# EAGLE schematic SCIENTECH_2201 (EAGLE 9.6.1)
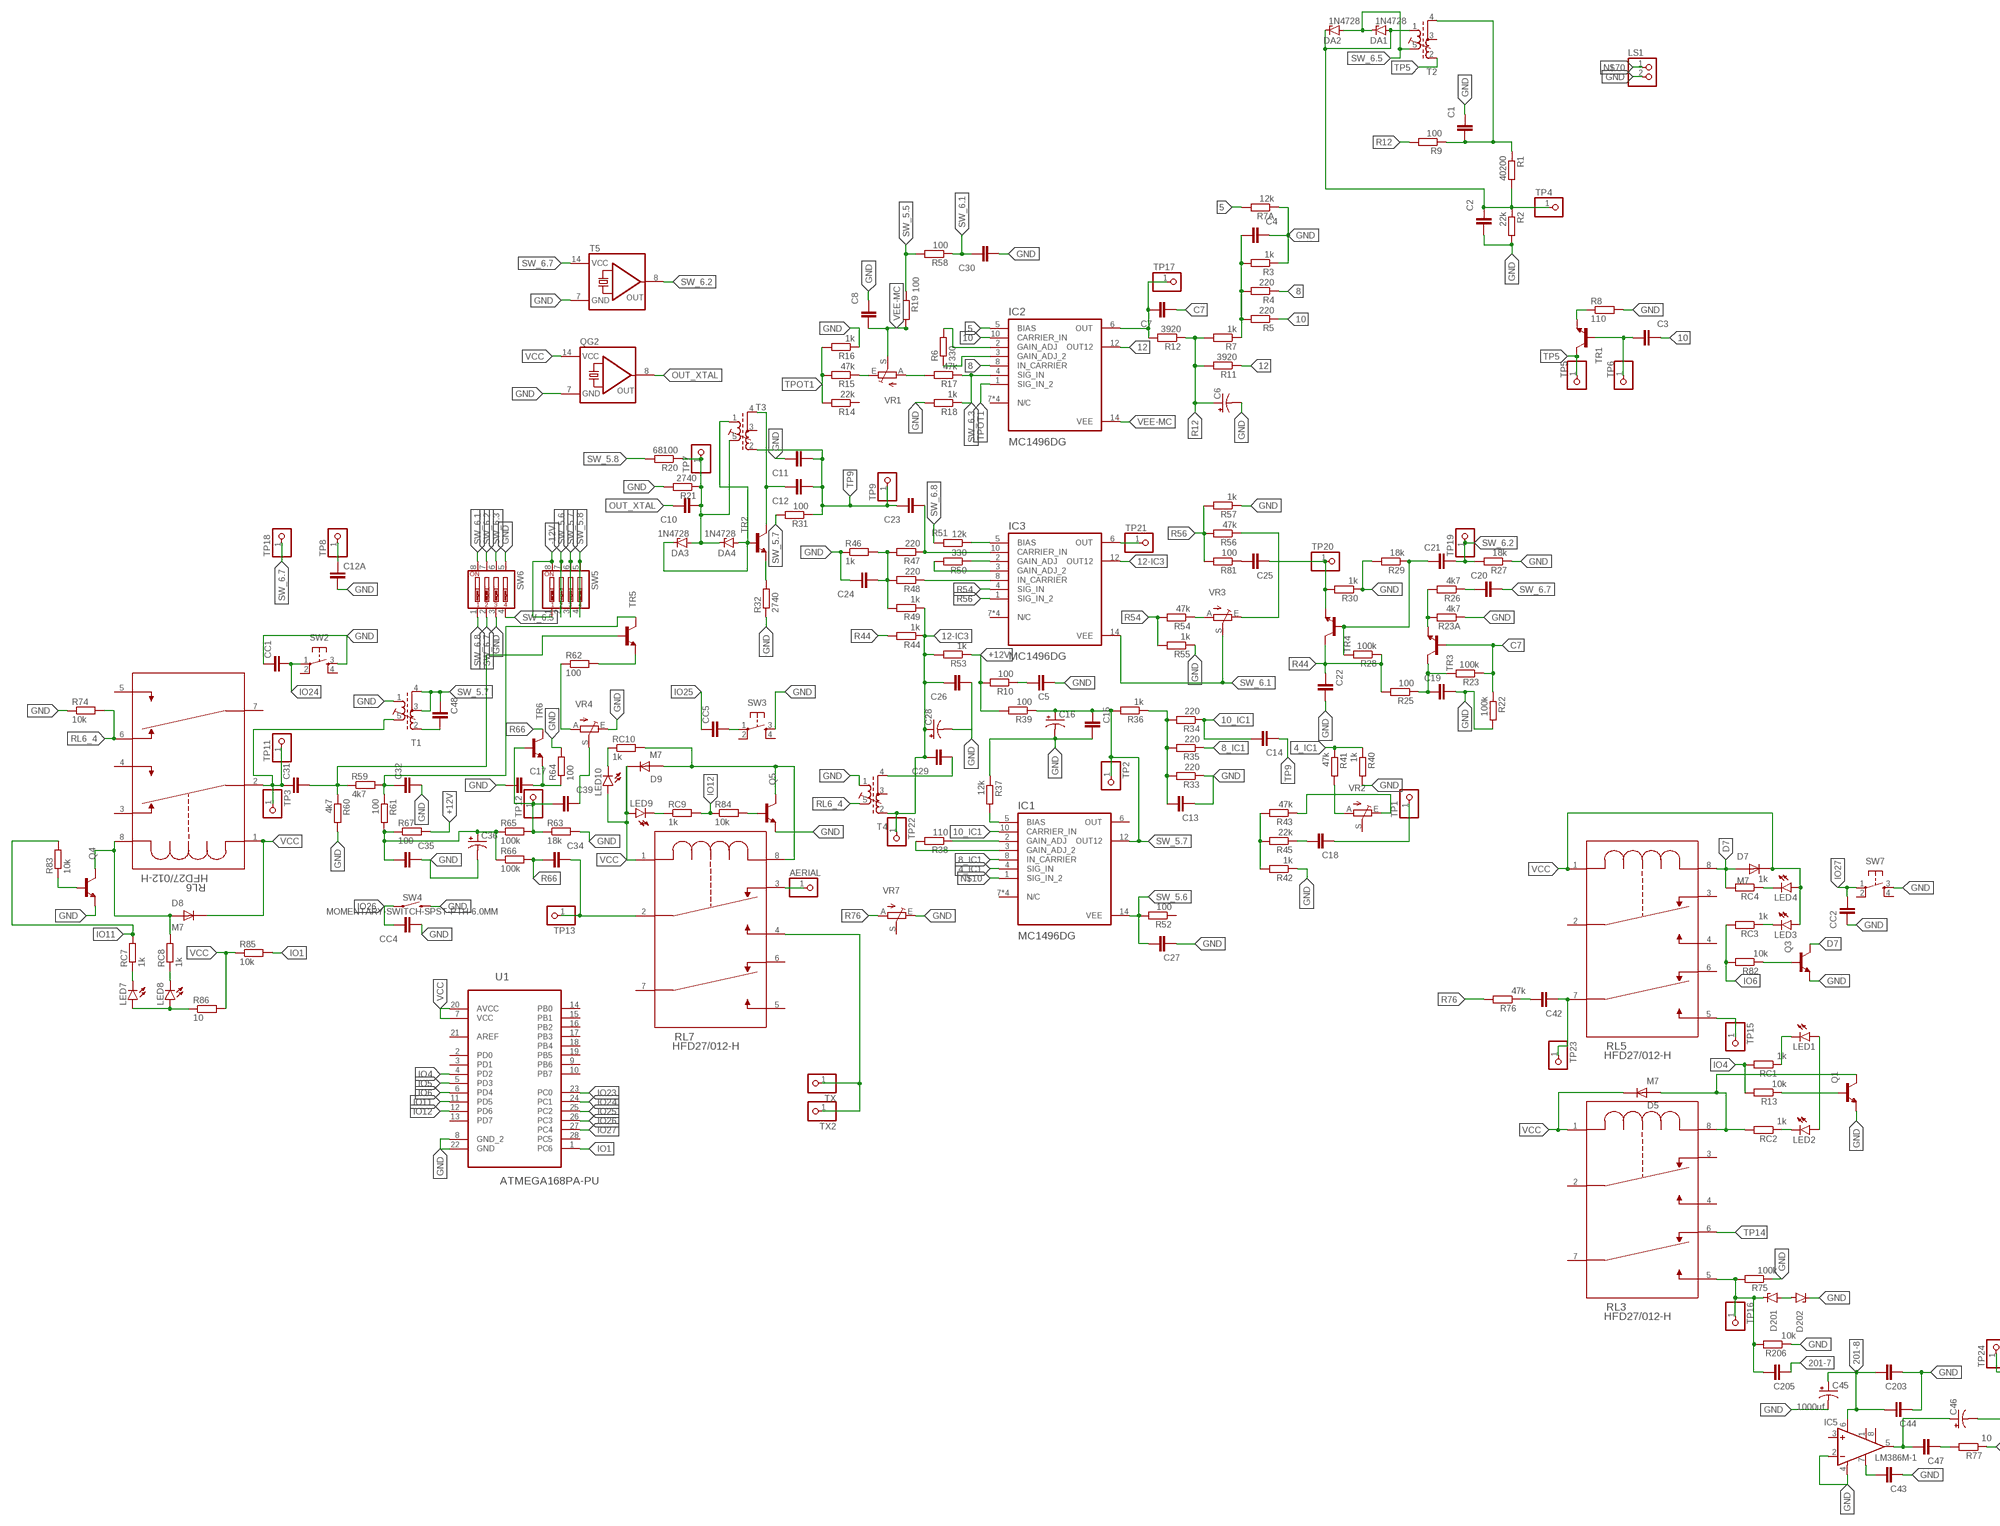
[diagram p0: schematic, sheet 1, part 1 of 2]
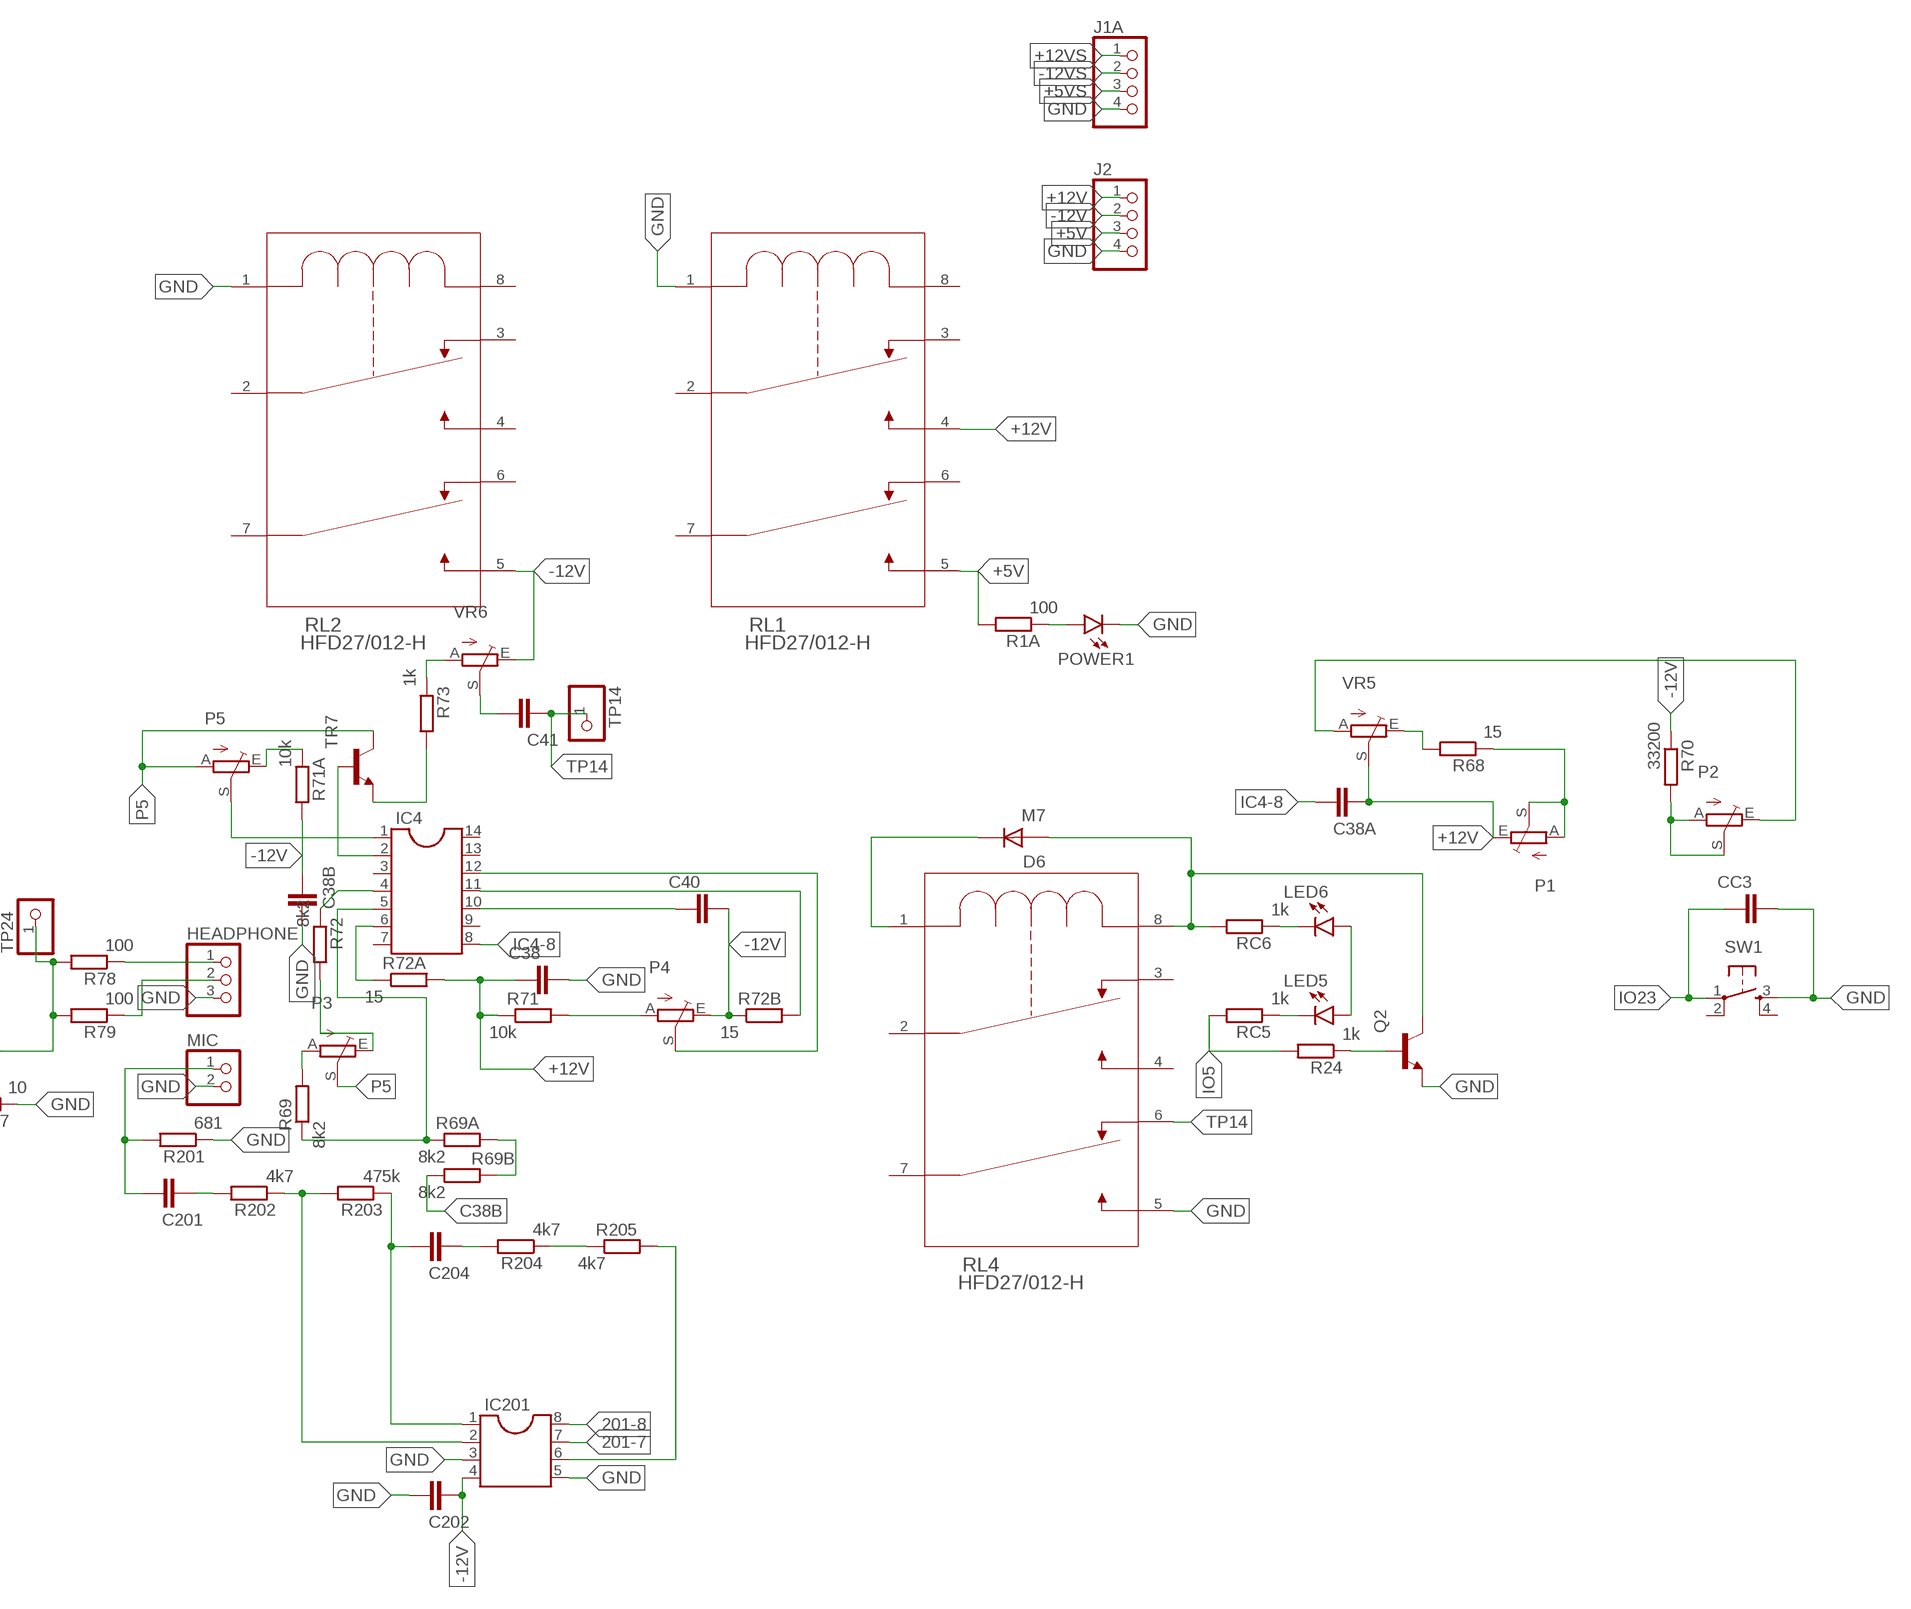
[diagram p1: schematic, sheet 1, part 2 of 2]

## Parts
AERIAL  PINHD-1X1  [1X01]
C1  C-EUC0805  [C0805]
C2  C-EUC0805  [C0805]
C3  C-EUC0805  [C0805]
C4  C-EUC0805  [C0805]
C5  C-EUC0805  [C0805]
C6  CPOL-US153CLV-0405  [153CLV-0405]
C7  C-EUC0805  [C0805]
C8  C-EUC0805  [C0805]
C10  C-EUC0805  [C0805]
C11  C-EUC0805  [C0805]
C12  C-EUC0805  [C0805]
C12A  C-EUC0805  [C0805]
C13  C-EUC0805  [C0805]
C14  C-EUC0805  [C0805]
C15  C-EUC0805  [C0805]
C16  CPOL-US153CLV-0405  [153CLV-0405]
C17  C-EUC0805  [C0805]
C18  C-EUC0805  [C0805]
C19  C-EUC0805  [C0805]
C20  C-EUC0805  [C0805]
C21  C-EUC0805  [C0805]
C22  C-EUC0805  [C0805]
C23  C-EUC0805  [C0805]
C24  C-EUC0805  [C0805]
C25  C-EUC0805  [C0805]
C26  C-EUC0805  [C0805]
C27  C-EUC0805  [C0805]
C28  CPOL-US153CLV-0405  [153CLV-0405]
C29  C-EUC0805  [C0805]
C30  C-EUC0805  [C0805]
C31  C-EUC0805  [C0805]
C32  C-EUC0805  [C0805]
C34  C-EUC0805  [C0805]
C35  C-EUC0805  [C0805]
C36  CPOL-US153CLV-0405  [153CLV-0405]
C38  C-EUC0805  [C0805]
C38A  C-EUC0805  [C0805]
C38B  C-EUC0805  [C0805]
C39  C-EUC0805  [C0805]
C40  C-EUC0805  [C0805]
C41  C-EUC0805  [C0805]
C42  C-EUC0805  [C0805]
C43  C-EUC0805  [C0805]
C44  C-EUC0805  [C0805]
C45  1000uf  CPOL-USE5-5  [E5-5]
C46  CPOL-US153CLV-0405  [153CLV-0405]
C47  C-EUC0805  [C0805]
C48  C-EUC0805  [C0805]
C201  C-EUC0805  [C0805]
C202  C-EUC0805  [C0805]
C203  C-EUC0805  [C0805]
C204  C-EUC0805  [C0805]
C205  C-EUC0805  [C0805]
CC1  C-EUC0805  [C0805]
CC2  C-EUC0805  [C0805]
CC3  C-EUC0805  [C0805]
CC4  C-EUC0805  [C0805]
CC5  C-EUC0805  [C0805]
D5  M7  [DIOM505270X240]
D6  M7  [DIOM505270X240]
D7  M7  [DIOM505270X240]
D8  M7  [DIOM505270X240]
D9  M7  [DIOM505270X240]
D201  1N4728  [DO41Z10]
D202  1N4728  [DO41Z10]
DA1  1N4728  [DO41Z10]
DA2  1N4728  [DO41Z10]
DA3  1N4728  [DO41Z10]
DA4  1N4728  [DO41Z10]
HEADPHONE  PINHD-1X3  [1X03]
IC1  MC1496DG  [SOIC127P600X175-14N]
IC2  MC1496DG  [SOIC127P600X175-14N]
IC3  MC1496DG  [SOIC127P600X175-14N]
IC4  DIL14  [DIL14]
IC5  LM386M-1  [SO08]
IC201  DIL8S  [SOCKET-08]
J1A  PINHD-1X4  [1X04]
J2  PINHD-1X4  [1X04]
LED1  LED3MM  [LED3MM]
LED2  LED3MM  [LED3MM]
LED3  LED3MM  [LED3MM]
LED4  LED3MM  [LED3MM]
LED5  LED3MM  [LED3MM]
LED6  LED3MM  [LED3MM]
LED7  LED3MM  [LED3MM]
LED8  LED3MM  [LED3MM]
LED9  LED3MM  [LED3MM]
LED10  LED3MM  [LED3MM]
LS1  PINHD-1X2  [1X02]
MIC  PINHD-1X2  [1X02]
P1  TRIM_EU-CA6V  [CA6V]
P2  TRIM_EU-CA6V  [CA6V]
P3  TRIM_EU-CA6V  [CA6V]
P4  TRIM_EU-CA6V  [CA6V]
P5  TRIM_EU-CA6V  [CA6V]
POWER1  LED3MM  [LED3MM]
Q1  1F  BC847  [SOT23]
Q2  1F  BC847  [SOT23]
Q3  1F  BC847  [SOT23]
Q4  1F  BC847  [SOT23]
Q5  1F  BC847  [SOT23]
QG2  QG5860  [DIL14S]
R1  40200  R-EU_R0805  [R0805]
R1A  100  R-EU_R0805  [R0805]
R2  22k  R-EU_R0805  [R0805]
R3  1k  R-EU_R0805  [R0805]
R4  220  R-EU_R0805  [R0805]
R5  220  R-EU_R0805  [R0805]
R6  330  R-EU_R0805  [R0805]
R7  1k  R-EU_R0805  [R0805]
R7A  12k  R-EU_R0805  [R0805]
R8  110  R-EU_R0805  [R0805]
R9  100  R-EU_R0805  [R0805]
R10  100  R-EU_R0805  [R0805]
R11  3920  R-EU_R0805  [R0805]
R12  3920  R-EU_R0805  [R0805]
R13  10k  R-EU_R0805  [R0805]
R14  22k  R-EU_R0805  [R0805]
R15  47k  R-EU_R0805  [R0805]
R16  1k  R-EU_R0805  [R0805]
R17  47k  R-EU_R0805  [R0805]
R18  1k  R-EU_R0805  [R0805]
R19  100  R-EU_R0805  [R0805]
R20  68100  R-EU_R0805  [R0805]
R21  2740  R-EU_R0805  [R0805]
R22  100k  R-EU_R0805  [R0805]
R23  100k  R-EU_R0805  [R0805]
R23A  4k7  R-EU_R0805  [R0805]
R24  1k  R-EU_R0805  [R0805]
R25  100  R-EU_R0805  [R0805]
R26  4k7  R-EU_R0805  [R0805]
R27  18k  R-EU_R0805  [R0805]
R28  100k  R-EU_R0805  [R0805]
R29  18k  R-EU_R0805  [R0805]
R30  1k  R-EU_R0805  [R0805]
R31  100  R-EU_R0805  [R0805]
R32  2740  R-EU_R0805  [R0805]
R33  220  R-EU_R0805  [R0805]
R34  220  R-EU_R0805  [R0805]
R35  220  R-EU_R0805  [R0805]
R36  1k  R-EU_R0805  [R0805]
R37  12k  R-EU_R0805  [R0805]
R38  110  R-EU_R0805  [R0805]
R39  100  R-EU_R0805  [R0805]
R40  1k  R-EU_R0805  [R0805]
R41  47k  R-EU_R0805  [R0805]
R42  1k  R-EU_R0805  [R0805]
R43  47k  R-EU_R0805  [R0805]
R44  1k  R-EU_R0805  [R0805]
R45  22k  R-EU_R0805  [R0805]
R46  1k  R-EU_R0805  [R0805]
R47  220  R-EU_R0805  [R0805]
R48  220  R-EU_R0805  [R0805]
R49  1k  R-EU_R0805  [R0805]
R50  330  R-EU_R0805  [R0805]
R51  12k  R-EU_R0805  [R0805]
R52  100  R-EU_R0805  [R0805]
R53  1k  R-EU_R0805  [R0805]
R54  47k  R-EU_R0805  [R0805]
R55  1k  R-EU_R0805  [R0805]
R56  47k  R-EU_R0805  [R0805]
R57  1k  R-EU_R0805  [R0805]
R58  100  R-EU_R0805  [R0805]
R59  4k7  R-EU_R0805  [R0805]
R60  4k7  R-EU_R0805  [R0805]
R61  100  R-EU_R0805  [R0805]
R62  100  R-EU_R0805  [R0805]
R63  18k  R-EU_R0805  [R0805]
R64  100  R-EU_R0805  [R0805]
R65  100k  R-EU_R0805  [R0805]
R66  100k  R-EU_R0805  [R0805]
R67  100  R-EU_R0805  [R0805]
R68  15  R-EU_R0805  [R0805]
R69  8k2  R-EU_R0805  [R0805]
R69A  8k2  R-EU_R0805  [R0805]
R69B  8k2  R-EU_R0805  [R0805]
R70  33200  R-EU_R0805  [R0805]
R71  10k  R-EU_R0805  [R0805]
R71A  10k  R-EU_R0805  [R0805]
R72  8k2  R-EU_R0805  [R0805]
R72A  15  R-EU_R0805  [R0805]
R72B  15  R-EU_R0805  [R0805]
R73  1k  R-EU_R0805  [R0805]
R74  10k  R-EU_R0805  [R0805]
R75  100k  R-EU_R0805  [R0805]
R76  47k  R-EU_R0805  [R0805]
R77  10  R-EU_R0805  [R0805]
R78  100  R-EU_R0805  [R0805]
R79  100  R-EU_R0805  [R0805]
R81  100  R-EU_R0805  [R0805]
R82  10k  R-EU_R0805  [R0805]
R83  10k  R-EU_R0805  [R0805]
R84  10k  R-EU_R0805  [R0805]
R85  10k  R-EU_R0805  [R0805]
R86  10  R-EU_R0805  [R0805]
R201  681  R-EU_R0805  [R0805]
R202  4k7  R-EU_R0805  [R0805]
R203  475k  R-EU_R0805  [R0805]
R204  4k7  R-EU_R0805  [R0805]
R205  4k7  R-EU_R0805  [R0805]
R206  10k  R-EU_R0805  [R0805]
RC1  1k  R-EU_R0805  [R0805]
RC2  1k  R-EU_R0805  [R0805]
RC3  1k  R-EU_R0805  [R0805]
RC4  1k  R-EU_R0805  [R0805]
RC5  1k  R-EU_R0805  [R0805]
RC6  1k  R-EU_R0805  [R0805]
RC7  1k  R-EU_R0805  [R0805]
RC8  1k  R-EU_R0805  [R0805]
RC9  1k  R-EU_R0805  [R0805]
RC10  1k  R-EU_R0805  [R0805]
RL1  HFD27/012-H  [RELAY_HFD27_HNG]
RL2  HFD27/012-H  [RELAY_HFD27_HNG]
RL3  HFD27/012-H  [RELAY_HFD27_HNG]
RL4  HFD27/012-H  [RELAY_HFD27_HNG]
RL5  HFD27/012-H  [RELAY_HFD27_HNG]
RL6  HFD27/012-H  [RELAY_HFD27_HNG]
RL7  HFD27/012-H  [RELAY_HFD27_HNG]
SW1  TAC_SWITCHPTH  [TACTILE-PTH]
SW2  TAC_SWITCHPTH  [TACTILE-PTH]
SW3  TAC_SWITCHPTH  [TACTILE-PTH]
SW4  MOMENTARY-SWITCH-SPST-PTH-6.0MM  [TACTILE_SWITCH_PTH_6.0MM]
SW5  SW_DIP-4  [EDG-04]
SW6  SW_DIP-4  [EDG-04]
SW7  TAC_SWITCHPTH  [TACTILE-PTH]
T1  71-24513-2  [71-5]
T2  71-24513-2  [71-5]
T3  71-24513-2  [71-5]
T4  71-24513-2  [71-5]
T5  QG5860  [DIL14S]
TP1  PINHD-1X1  [1X01]
TP2  PINHD-1X1  [1X01]
TP3  PINHD-1X1  [1X01]
TP4  PINHD-1X1  [1X01]
TP5  PINHD-1X1  [1X01]
TP6  PINHD-1X1  [1X01]
TP7  PINHD-1X1  [1X01]
TP8  PINHD-1X1  [1X01]
TP9  PINHD-1X1  [1X01]
TP11  PINHD-1X1  [1X01]
TP12  PINHD-1X1  [1X01]
TP13  PINHD-1X1  [1X01]
TP14  PINHD-1X1  [1X01]
TP15  PINHD-1X1  [1X01]
TP16  PINHD-1X1  [1X01]
TP17  PINHD-1X1  [1X01]
TP18  PINHD-1X1  [1X01]
TP19  PINHD-1X1  [1X01]
TP20  PINHD-1X1  [1X01]
TP21  PINHD-1X1  [1X01]
TP22  PINHD-1X1  [1X01]
TP23  PINHD-1X1  [1X01]
TP24  PINHD-1X1  [1X01]
TR1  1AM  BC847  [SOT23]
TR2  1AM  BC847  [SOT23]
TR3  1AM  BC847  [SOT23]
TR4  1AM  BC847  [SOT23]
TR5  1AM  BC847  [SOT23]
TR6  1AM  BC847  [SOT23]
TR7  1AM  BC847  [SOT23]
TX  PINHD-1X1  [1X01]
TX2  PINHD-1X1  [1X01]
U1  ATMEGA168PA-PU  [DIP254P762X457-28]
VR1  TRIM_EU-PT10S  [PT-10S]
VR2  TRIM_EU-PT10S  [PT-10S]
VR3  TRIM_EU-PT10S  [PT-10S]
VR4  TRIM_EU-PT10S  [PT-10S]
VR5  TRIM_EU-PT10S  [PT-10S]
VR6  TRIM_EU-PT10S  [PT-10S]
VR7  TRIM_EU-PT10S  [PT-10S]

## Nets
4_IC1: IC1.4(SIG_IN) R40.1 R41.1
5: IC2.5(BIAS) R7A.2
8: IC2.8(IN_CARRIER) R4.1
8_IC1: IC1.8(IN_CARRIER) R35.1
10: C3.2 IC2.10(CARRIER_IN) R5.1
10_IC1: C14.2 IC1.10(CARRIER_IN) R34.1
12: IC2.12(OUT12) R11.1
12-IC3: C26.2 C28.+ C29.2 IC3.12(OUT12) R44.1 R49.1 R53.2 T4.2(A1) TP22.1
201-7: C205.1 IC201.7
201-8: C44.2 C45.+ C203.2 IC5.6(VS) IC201.8
+5V: J2.3 R1A.2 RL1.5
+5VS: J1A.3
+12V: C38.1 C38A.1 J2.1 P1.E R10.2 R39.2 R53.1 R67.2 R71.1 R72A.2 RL1.4 VR5.S
+12VS: J1A.1
-12V: C38B.1 C40.2 C202.1 IC201.4 J2.2 P4.E R70.1 R71A.2 R72B.1 RL2.5 SW5.1 SW5.8 VR6.E
-12VS: J1A.2
C7: C7.1 R22.1 R23.1 TR3.1(B)
C38B: R69B.1
D7: D7.A Q3.3(C) RC4.2 RL5.8
GND: C1.2 C2.1 C4.2 C5.1 C6.- C8.2 C11.2 C12A.2 C13.1 C15.2 C16.- C17.1 C19.2 C22.2 C24.2 C26.1 C27.1 C28.- C30.1 C32.2 C35.2 C36.- C38.2 C38B.2 C43.1 C44.1 C45.- C202.2 C203.1 CC1.1 CC2.1 CC3.2 CC4.1 D202.C HEADPHONE.3 IC5.2(-IN) IC5.4(GND) IC201.3 IC201.5 J1A.4 J2.4 LS1.2 MIC.2 POWER1.K(C) Q1.2(E) Q2.2(E) Q3.2(E) Q4.2(E) Q5.2(E) QG2.7(GND) R2.2 R3.1 R7A.1 R8.2 R16.1 R18.2 R21.2 R22.2 R23A.1 R27.1 R29.2 R30.1 R32.1 R33.1 R37.1 R40.2 R42.1 R46.1 R55.1 R57.1 R60.2 R63.2 R64.2 R74.1 R75.1 R77.1 R201.1 R206.1 RL1.1 RL2.1 RL4.5 SW1.3 SW2.3 SW3.3 SW4.3 SW6.3 SW6.5 SW7.3 T1.1(E2) T4.1(E2) T5.7(GND) U1.8(GND_2) U1.22(GND) VR4.E VR7.E
IC4-8: C38A.2 IC4.8
IO1: R85.2 U1.1(PC6)
IO4: R13.2 RC1.2 U1.4(PD2)
IO5: R24.2 RC5.2 U1.5(PD3)
IO6: R82.2 RC3.2 U1.6(PD4)
IO11: R83.2 RC7.2 U1.11(PD5)
IO12: R84.1 RC9.2 U1.12(PD6)
IO23: CC3.1 SW1.1 U1.23(PC0)
IO24: CC1.2 SW2.1 U1.24(PC1)
IO25: CC5.1 U1.25(PC2)
IO26: CC4.2 SW4.1 U1.26(PC3)
IO27: CC2.2 SW7.1 U1.27(PC4)
N$2: LED7.A LED8.A R86.1
N$3: LED7.K(C) RC7.1
N$4: LED8.K(C) RC8.1
N$5: D8.A Q4.3(C) RC8.2 RL6.8
N$6: C48.2 T1.2(A1)
N$7: D9.A Q5.3(C) RC10.2 RL7.8
N$8: C31.2 R59.1 R60.1 TR5.1(B)
N$9: C32.1 R59.2 R61.1 TR5.3(C)
N$10: IC1.1(SIG_IN_2)
N$11: C5.2 R10.1
N$12: C39.1 R63.1 R65.2 TP12.1 TR6.1(B)
N$13: RL7.4 TX2.1 TX.1
N$14: C34.2 RL7.2(3_2) TP13.1
N$15: LED9.K(C) RC9.1
N$16: LED10.K(C) RC10.1
N$17: Q5.1(B) R84.2
N$18: AERIAL.1 RL7.3
N$19: CC5.2 SW3.1
N$20: Q4.1(B) R83.1
N$21: IC2.3(GAIN_ADJ_2) R6.1
N$22: IC2.2(GAIN_ADJ) R6.2
N$23: R17.2 VR1.A
N$24: R15.1 VR1.E
N$26: C21.1 R28.2 R29.1 TR4.1(B)
N$27: C7.2 IC2.6(OUT) R12.2 TP17.1
N$28: C29.1 T4.4(E1)
N$29: C4.1 R3.2 R4.2 R5.2 R7.1
N$30: IC3.2(GAIN_ADJ) R50.1
N$31: IC3.3(GAIN_ADJ_2) R50.2
N$32: IC3.6(OUT) TP21.1
N$33: IC3.5(BIAS) R51.1
N$34: IC3.8(IN_CARRIER) R48.1
N$35: C23.1 IC3.10(CARRIER_IN) R47.1
N$36: C24.1 R46.2 R47.2 R48.2 R49.2
N$37: C12.2 T3.4(E1) TR2.3(C)
N$38: R32.2 TR2.2(E)
N$39: DA3.C DA4.A T3.1(E2) TR2.1(B)
N$40: C10.1 DA3.A DA4.C R20.1 R21.1 T3.5(A2) TP7.1
N$41: C25.2 R81.1
N$42: R54.1 VR3.A
N$43: R56.1 VR3.E
N$44: C25.1 R30.2 TP20.1 TR4.2(E)
N$45: IC1.2(GAIN_ADJ) R38.1
N$47: C19.1 R23.2 R25.1 TR3.3(C)
N$48: C13.2 R33.2 R34.2 R35.2 R36.1
N$49: R23A.2 R26.2 TR3.2(E)
N$50: C20.1 R26.1
N$51: IC1.3(GAIN_ADJ_2) R38.2
N$52: R42.2 R43.2 R45.2
N$53: C18.2 R45.1
N$54: R43.1 VR2.E
N$55: C18.1 TP1.1
N$56: R41.2 VR2.A
N$57: IC1.5(BIAS) R37.2
N$58: C39.2 VR4.S
N$59: C1.1 R1.1 R9.1 T2.4(E1)
N$60: R8.1 TR1.2(E)
N$61: C3.1 TP6.1 TR1.1(B)
N$62: C12A.1 TP8.1
N$63: LED4.K(C) RC4.1
N$64: LED3.K(C) RC3.1
N$66: Q3.1(B) R82.1
N$67: RL5.5 TP15.1
N$68: C42.1 RL5.7 TP23.1
N$69: C42.2 R76.1
N$70: LS1.1
N$72: D5.A Q1.3(C) RC2.2 RL3.8
N$73: LED1.A LED2.A
N$74: LED1.K(C) RC1.1
N$75: LED2.K(C) RC2.1
N$76: Q1.1(B) R13.1
N$77: C205.2 D201.C R75.2 R206.2 RL3.5 TP16.1
N$78: D201.A D202.A
N$79: C46.+ C47.2 IC5.5(OUT)
N$80: POWER1.A R1A.1
N$81: C43.2 IC5.7(BYPASS)
N$82: C47.1 R77.2
N$83: C46.- R78.2 R79.2 TP24.1
N$84: HEADPHONE.1 R78.1
N$85: HEADPHONE.2 R79.1
N$86: C201.2 MIC.1 R201.2
N$87: C201.1 R202.2
N$88: IC201.2 R202.1 R203.2
N$89: C204.2 IC201.1 R203.1
N$90: C204.1 R204.2
N$91: R204.1 R205.1
N$92: P2.A P2.S R70.2
N$93: IC201.6 R205.2
N$94: C41.2 VR6.S
N$95: R73.1 VR6.A
N$96: R73.2 TR7.2(E)
N$97: R69A.2 R69B.2
N$98: P5.E R71A.1
N$99: IC4.2 TR7.1(B)
N$100: IC4.1 P5.S
N$101: IC4.6 R72A.1
N$102: IC4.4 R72.1
N$103: P3.E R72.2
N$104: P3.A R69.2
N$105: IC4.5 R69.1 R69A.1
N$106: D6.C RL4.1
N$107: P4.A R71.2
N$108: R68.2 VR5.E
N$109: IC4.11 R72B.2
N$110: C40.1 IC4.10
N$111: IC4.12 P4.S
N$112: D6.A Q2.3(C) RC6.2 RL4.8
N$113: P1.A P1.S R68.1
N$114: LED6.K(C) RC6.1
N$115: LED5.A LED6.A
N$116: LED5.K(C) RC5.1
N$117: P2.E VR5.A
N$118: Q2.1(B) R24.1
N$119: C2.2 DA1.A DA2.C R1.2 R2.1 T2.1(E2) TP4.1
N$121: R62.1 VR4.A
N$122: R62.2 TR5.2(E)
N$123: C17.2 R64.1 TR6.2(E)
OUT_XTAL: C10.2 QG2.8(OUT)
P5: P3.S P5.A TR7.3(C)
R12: C6.+ R7.2 R9.2 R11.2 R12.1
R44: C22.1 R25.2 R28.1 R44.2 TR4.3(C)
R54: IC3.4(SIG_IN) R54.2 R55.2
R56: IC3.1(SIG_IN_2) R56.2 R57.2 R81.2
R66: C34.1 R66.2 TR6.3(C)
R67: C35.1 C36.+ R61.2 R65.1 R66.1 R67.1
R76: R76.2 VR7.A
RL6_4: R74.2 RL6.6 T4.5(A2)
SW_5.5: R19.1 R58.2
SW_5.6: C27.2 IC1.14(VEE) R52.2 SW5.2 SW5.7
SW_5.7: C15.1 C16.+ C48.1 IC1.12(OUT12) R31.2 R36.2 R39.1 SW5.3 SW5.6 T1.3(Z) T1.4(E1) TP2.1
SW_5.8: R20.2 SW5.4 SW5.5
SW_6.1: C30.2 IC3.14(VEE) R58.1 SW6.8 VR3.S
SW_6.2: C21.2 R27.2 SW6.7 T5.8(OUT) TP19.1
SW_6.3: IC2.4(SIG_IN) R17.1 R18.1 SW6.6
SW_6.5: DA1.C DA2.A SW6.4 T2.5(A2)
SW_6.7: C20.2 SW6.2 T5.14(VCC) TP18.1
SW_6.8: R51.2 SW6.1
TP3: C31.1 RL6.2(3_2) T1.5(A2) TP3.1 TP11.1
TP5: T2.2(A1) TP5.1 TR1.3(C)
TP9: C11.1 C12.1 C14.1 C23.2 R31.1 T3.2(A1) TP9.1
TP14: C41.1 RL3.6 RL4.6 TP14.1
TPOT1: IC2.1(SIG_IN_2) R14.2 R15.2 R16.2
VCC: D5.C D7.C D8.C D9.C LED3.A LED4.A LED9.A LED10.A QG2.14(VCC) R85.1 R86.2 RL3.1 RL5.1 RL6.1 RL7.1 U1.7(VCC) U1.20(AVCC)
VEE-MC: C8.1 IC2.14(VEE) R19.2 VR1.S
Unconnected: IC1.6(OUT) IC1.7(N/C) IC1.9(N/C) IC1.11(N/C) IC1.13(N/C) IC2.7(N/C) IC2.9(N/C) IC2.11(N/C) IC2.13(N/C) IC3.7(N/C) IC3.9(N/C) IC3.11(N/C) IC3.13(N/C) IC4.3 IC4.7 IC4.9 IC4.13 IC4.14 IC5.1(GAIN) IC5.3(+IN) IC5.8(GAIN) R14.1 R52.1 RL1.2(3_2) RL1.3 RL1.6 RL1.7 RL1.8 RL2.2(3_2) RL2.3 RL2.4 RL2.6 RL2.7 RL2.8 RL3.2(3_2) RL3.3 RL3.4 RL3.7 RL4.2(3_2) RL4.3 RL4.4 RL4.7 RL5.2(3_2) RL5.3 RL5.4 RL5.6 RL6.3 RL6.4 RL6.5 RL6.7 RL7.5 RL7.6 RL7.7 SW1.2 SW1.4 SW2.2 SW2.4 SW3.2 SW3.4 SW7.2 SW7.4 T1.S1 T1.S2 T2.3(Z) T2.S1 T2.S2 T3.3(Z) T3.S1 T3.S2 T4.3(Z) T4.S1 T4.S2 U1.2(PD0) U1.3(PD1) U1.9(PB6) U1.10(PB7) U1.13(PD7) U1.14(PB0) U1.15(PB1) U1.16(PB2) U1.17(PB3) U1.18(PB4) U1.19(PB5) U1.21(AREF) U1.28(PC5) VR2.S VR7.S

## Library data of the parts
AERIAL TP1-TP9 TP11-TP24 TX TX2 = adafruit:PINHD-1X1: Pin header 1x1 for 0.1" spacing With round pins
C1-C5 C7 C8 C10-C12 C12A C13-C15 C17-C27 C29-C32 C34 C35 C38 C38A C38B C39-C44 C47 C48 C201-C205 CC1-CC5 = rcl:C-EU: CAPACITOR, European symbol; SPICEPREFIX: C
C6 C16 C28 C36 C45 C46 = rcl:CPOL-US: POLARIZED CAPACITOR, American symbol; SPICEPREFIX: C
D5-D9 = M7:M7: none Check availability <https://pricing.snapeda.com/parts/M7/Diotec%20Semiconductor/view-part?ref=eda>; AVAILABILITY: In Stock; DESCRIPTION: Diode Standard 1000 V 1A Surface Mount DO-214AC (SMA); MF: Diotec Semiconductor; MP: M7; PACKAGE: None; PRICE: None; PURCHASE-URL: https://pricing.snapeda.com/search/part/M7/?ref=eda
D201 D202 DA1-DA4 = diode:1N4728: Z DIODE 3.3 V, 1W, 5 percent
HEADPHONE = adafruit:PINHD-1X3: PIN HEADER
IC1-IC3 = MC1496DG:MC1496DG: Check availability <https://pricing.snapeda.com/parts/MC1496DG/ON%20Semiconductor/view-part?ref=eda>; AVAILABILITY: In Stock; CHECK_PRICES: https://www.snapeda.com/parts/MC1496DG/Onsemi/view-part/?ref=eda; DESCRIPTION: RF IC Modulator/Demodulator FM 300MHz - 14-SOIC; MF: ON Semiconductor; MP: MC1496DG; PACKAGE: SOIC-14 ON Semiconductor; PRICE: None; PURCHASE-URL: https://www.snapeda.com/api/url_track_click_mouser/?unipart_id=214251&manufacturer=ON Semiconductor&part_name=MC1496DG&search_term=None; SNAPEDA_LINK: https://www.snapeda.com/parts/MC1496DG/Onsemi/view-part/?ref=snap
IC4 = ic-package:DIL14: Dual In Line / Socket
IC5 = linear:LM386?-*: Low Voltage Audio Power Amplifier Source: http://cache.national.com/ds/LM/LM386.pdf
IC201 = ic-package:DIL8: Dual In Line / Socket
J1A J2 = pinhead:PINHD-1X4: PIN HEADER
LED1-LED10 POWER1 = led:LED: LED OSRAM: - CHIPLED LG R971, LG N971, LY N971, LG Q971, LY Q971, LO R971, LY R971 LH N974, LH R974 LS Q976, LO Q976, LY Q976 LO Q996 - Hyper CHIPLED LW Q18S LB Q993, LB Q99A, LB R99A - SideLED LS A670, LO A670, LY A670, LG A670, LP A670 LB A673, LV A673, LT A673, LW A673 LH A674 LY A675 LS A676, LA A676, LO A676, LY A676, LW A676 LS A679, LY A679, LG A679 - Hyper Micro SIDELED® LS Y876, LA Y876, LO Y876, LY Y876 LT Y87S - SmartLED LW L88C, LW L88S LB L89C, LB L89S, LG L890 LS L89K, LO L89K, LY L89K LS L896, LA L896, LO L896, LY L896 - TOPLED LS T670, LO T670, LY T670, LG T670, LP T670 LSG T670, LSP T670, LSY T670, LOP T670, LYG T670 LG T671, LOG T671, LSG T671 LB T673, LV T673, LT T673, LW T673 LH T674 LS T676, LA T676, LO T676, LY T676, LB T676, LH T676, LSB T676, LW T676 LB T67C, LV T67C, LT T67C, LS T67K, LO T67K, LY T67K, LW E67C LS E67B, LA E67B, LO E67B, LY E67B, LB E67C, LV E67C, LT E67C LW T67C LS T679, LY T679, LG T679 LS T770, LO T770, LY T770, LG T770, LP T770 LB T773, LV T773, LT T773, LW T773 LH T774 LS E675, LA E675, LY E675, LS T675 LS T776, LA T776, LO T776, LY T776, LB T776 LHGB T686 LT T68C, LB T68C - Hyper Mini TOPLED® LB M676 - Mini TOPLED Santana® LG M470 LS M47K, LO M47K, LY M47K Source: http://www.osram.convergy.de LUXEON: - LUMILED® LXK2-PW12-R00, LXK2-PW12-S00, LXK2-PW14-U00, LXK2-PW14-V00 LXK2-PM12-R00, LXK2-PM12-S00, LXK2-PM14-U00 LXK2-PE12-Q00, LXK2-PE12-R00, LXK2-PE12-S00, LXK2-PE14-T00, LXK2-PE14-U00 LXK2-PB12-K00, LXK2-PB12-L00, LXK2-PB12-M00, LXK2-PB14-N00, LXK2-PB14-P00, LXK2-PB14-Q00 LXK2-PR12-L00, LXK2-PR12-M00, LXK2-PR14-Q00, LXK2-PR14-R00 LXK2-PD12-Q00, LXK2-PD12-R00, LXK2-PD12-S00 LXK2-PH12-R00, LXK2-PH12-S00 LXK2-PL12-P00, LXK2-PL12-Q00, LXK2-PL12-R00 Source: www.luxeon.com KINGBRIGHT: KA-3528ASYC Source: www.kingbright.com
LS1 MIC = pinhead:PINHD-1X2: PIN HEADER
P1-P5 VR1-VR7 = pot:TRIM_EU-: POTENTIOMETER
Q1-Q5 TR1-TR7 = transistor:BC847: NPN TRANSISTOR
QG2 T5 = crystal:QG5860: CRYSTAL RESONATOR; OC_FARNELL: unknown; OC_NEWARK: unknown
R1 R1A R2-R7 R7A R8-R23 R23A R24-R69 R69A R69B R70 R71 R71A R72 R72A R72B R73-R79 R81-R86 R201-R206 RC1-RC10 = rcl:R-EU_: RESISTOR, European symbol; SPICEPREFIX: R
RL1-RL7 = HFD27:HFD27/012-H; COPYRIGHT: Copyright (C) 2023 Ultra Librarian. All rights reserved.; MANUFACTURER_PART_NUMBER: HFD27/012-H; MFR_NAME: Hongfa
SW1-SW3 SW7 = SparkFun-Retired:TAC_SWITCH: Momentary Switch Button commonly used for reset or general input. Spark Fun Electronics SKU : COM-00097 SMT- SWCH-08247
SW4 = SparkFun-Switches:MOMENTARY-SWITCH-SPST: Momentary Switch (Pushbutton) - SPST Normally-open (NO) SPST momentary switches (buttons, pushbuttons). Variants PTH-12MM - 12mm square, through-hole Momentary Pushbutton Switch - 12mm Square <https://www.sparkfun.com/products/9190> (COM-09190) PTH-6.0MM, PTH-6.0MM-KIT - 6.0mm square, through-hole Mini Pushbutton Switch <https://www.sparkfun.com/products/97> (COM-00097) KIT package intended for soldering kit's - only one side of pads' copper is exposed. PTH-RIGHT-ANGLE-KIT - Right-angle, through-hole Right Angle Tactile Button <https://www.sparkfun.com/products/10791> - Used on SparkFun BigTime Watch Kit <https://www.sparkfun.com/products/11734> SMD-12MM - 12mm square, surface-mount Tactile Button - SMD (12mm) <https://www.sparkfun.com/products/12993> (COM-12993) Used on SparkFun PicoBoard <https://www.sparkfun.com/products/11888> SMD-4.5MM - 4.5mm Square Trackball Switch Used on SparkFun Blackberry Trackballer Breakout <https://www.sparkfun.com/products/13169> SMD-4.6MMX2.8MM - 4.60mm x 2.80mm, surface mount Used on SparkFun Pro Micro - RP2040 <https://www.sparkfun.com/products/17717> SMD-5.2MM, SMD-5.2-REDUNDANT - 5.2mm square, surface-mount Mini Pushbutton Switch - SMD <https://www.sparkfun.com/products/8720> (COM-08720) Used on Arduino Pro Mini <https://www.sparkfun.com/products/11114> REDUNDANT package connects both switch circuits together SMD-6.0X3.5MM - 6.0 x 3.5mm, surface mount Momentary Reset Switch SMD <https://www.sparkfun.com/products/8229> (COM-08229) SMD-6.2MM-TALL - 6.2mm square, surface mount Tactile Button - SMD (6mm) <https://www.sparkfun.com/products/12992> Used on SparkFun Digital Sandbox <https://www.sparkfun.com/products/12651> SMD-RIGHT-ANGLE - Right-angle, surface mount Used on SparkFun Block for Intel® Edison - Arduino <https://www.sparkfun.com/products/13036>; PROD_ID: SWCH-08441; SF_SKU: COM-00097
SW5 SW6 = special:SW_DIP-4: DIP SWITCH
T1-T4 = inductor-neosid:71-: RF TRANSFORMER adjustable RF coil/transformer; OC_FARNELL: unknown; OC_NEWARK: unknown
U1 = ATMEGA168PA-PU:ATMEGA168PA-PU: MCU Check availability <https://pricing.snapeda.com/parts/ATMEGA168PA-PU/Microchip/view-part?ref=eda>; AVAILABILITY: In Stock; CHECK_PRICES: https://www.snapeda.com/parts/ATMEGA168PA-PU/Microchip/view-part/?ref=eda; DESCRIPTION: AVR AVR® ATmega Microcontroller IC 8-Bit 20MHz 16KB (8K x 16) FLASH 28-PDIP; MF: Microchip; MP: ATMEGA168PA-PU; PACKAGE: PDIP-28 Microchip; PRICE: None; PURCHASE-URL: https://www.snapeda.com/api/url_track_click_mouser/?unipart_id=379310&manufacturer=Microchip&part_name=ATMEGA168PA-PU&search_term=None; SNAPEDA_LINK: https://www.snapeda.com/parts/ATMEGA168PA-PU/Microchip/view-part/?ref=snap